# Altium schematic sheet P02_ Apollo 4 Blue Plus.SchDoc
size C; SheetNumber: 2; SheetTotal: 3
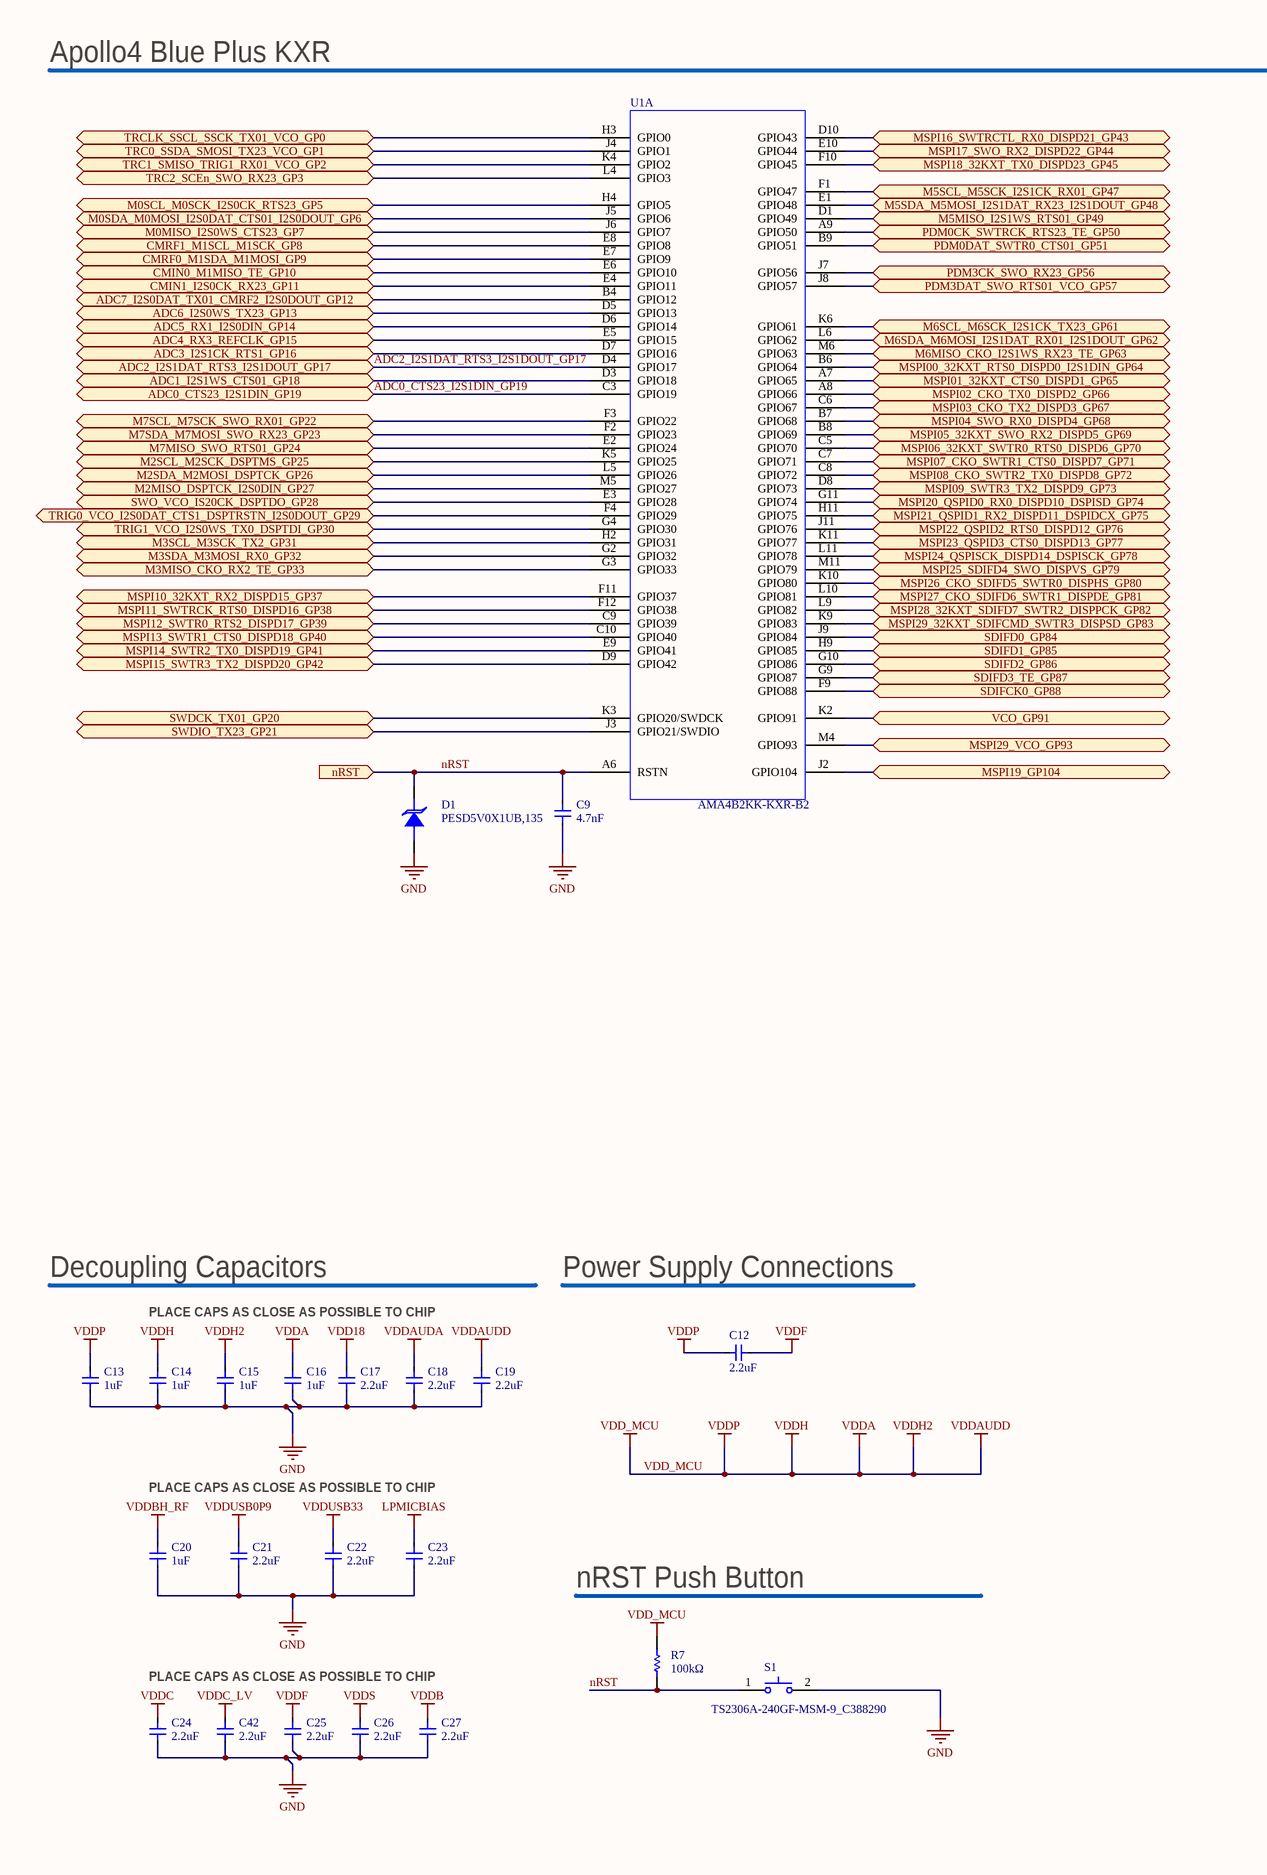
[diagram p0: P02_ Apollo 4 Blue Plus.SchDoc, left]
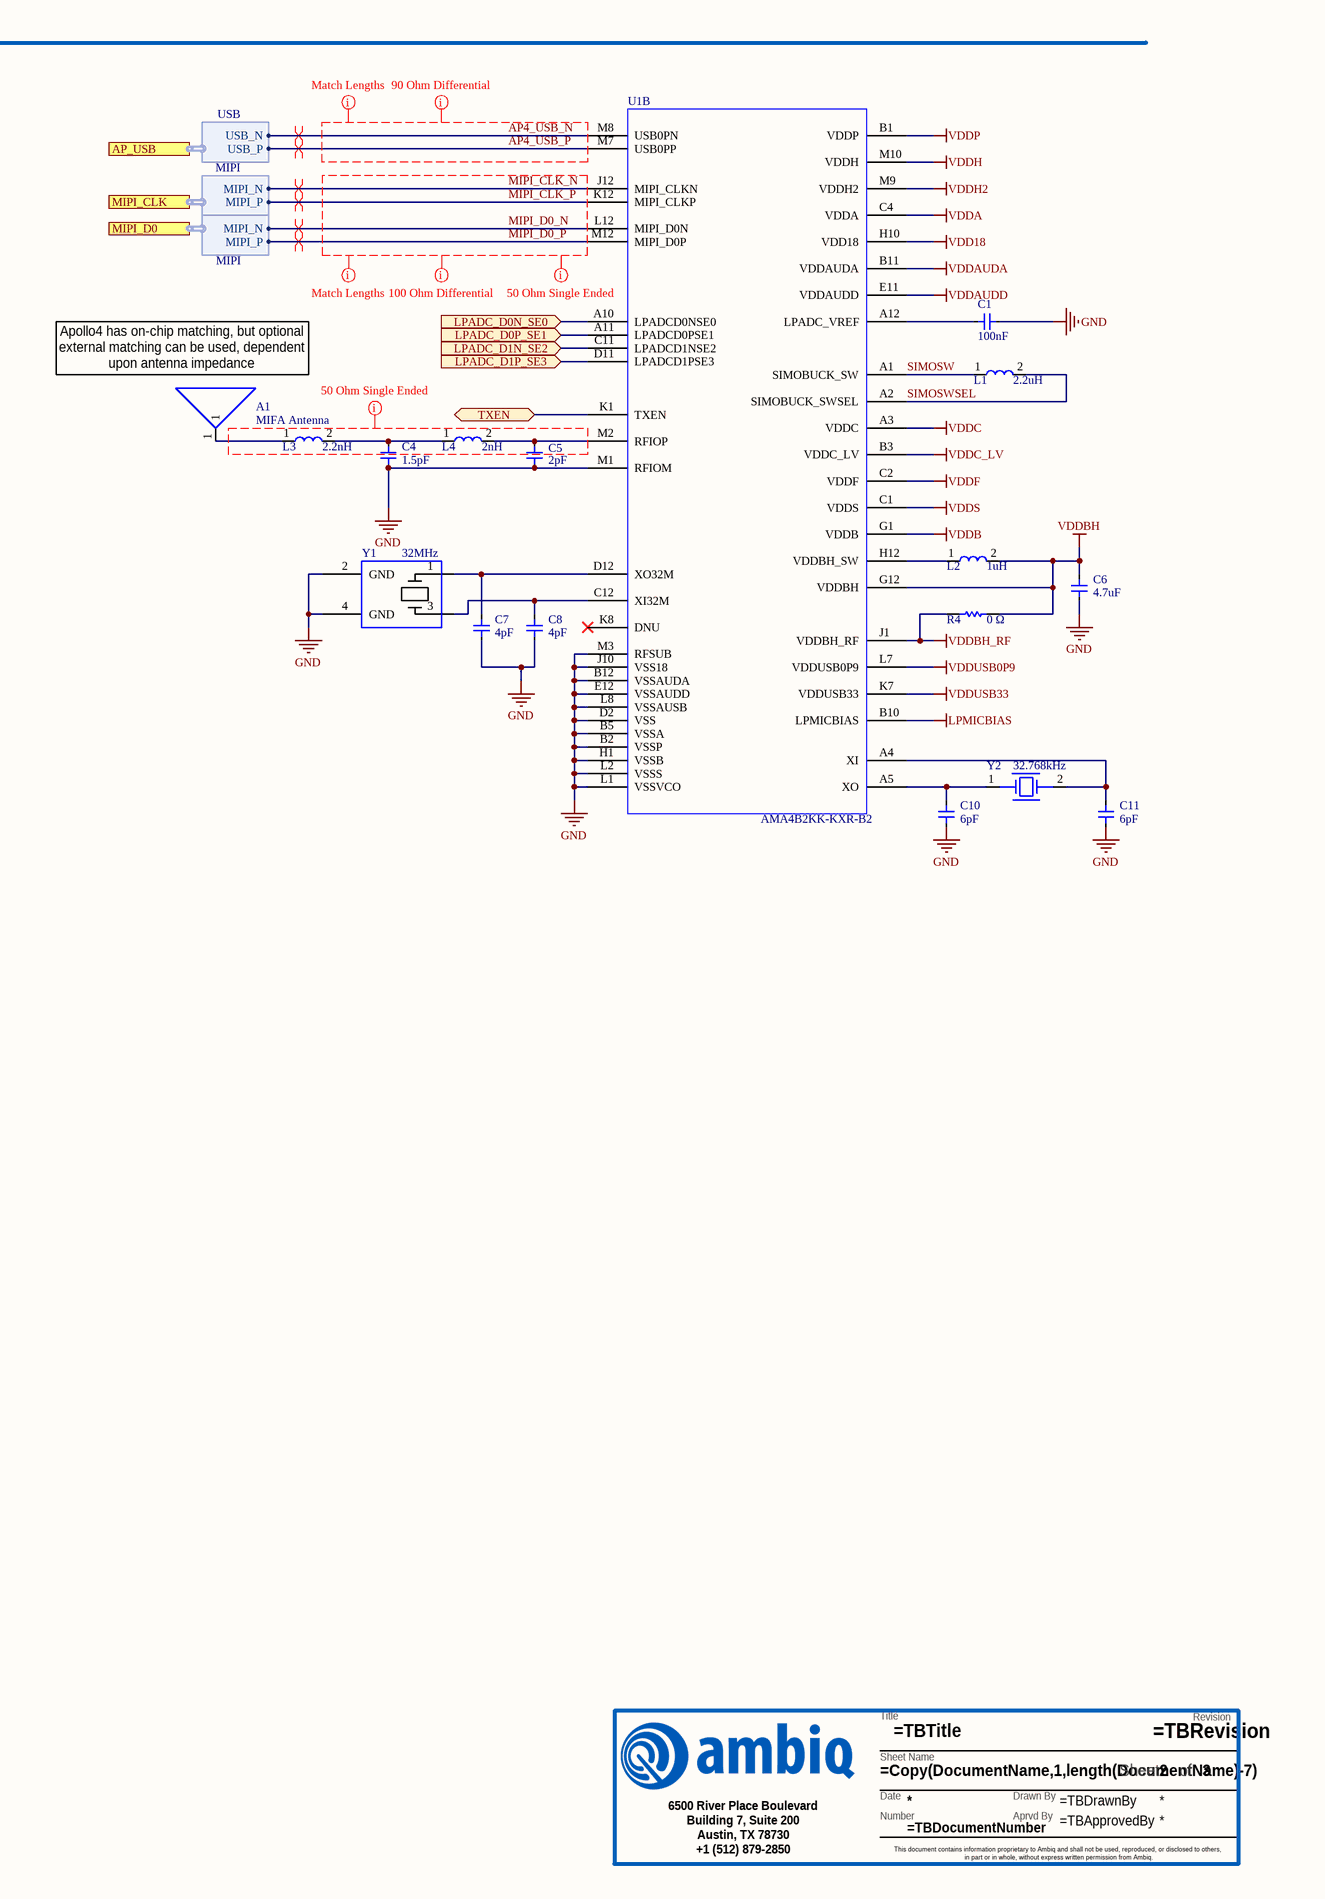
[diagram p1: P02_ Apollo 4 Blue Plus.SchDoc, right]

## Parts
?  TitleBlock  (value not drawn)  (graphical)
A1  MIFA Antenna  [ANT-2.4GHZ-8.0X1.0MM]  (no BOM)
C1  100nF  [IPC_B]
C4  1.5pF  [IPC_C_2]
C5  2pF  [IPC_C_2]
C6  4.7uF  [IPC_C_2]
C7  4pF  [IPC_C]
C8  4pF  [IPC_C]
C9  4.7nF  [IPC_C]
C10  6pF  [IPC_C]
C11  6pF  [IPC_C]
C12  2.2uF  [IPC_C]
C13  1uF  [IPC_C]
C14  1uF  [IPC_C]
C15  1uF  [IPC_C]
C16  1uF  [IPC_C]
C17  2.2uF  [IPC_C]
C18  2.2uF  [IPC_C]
C19  2.2uF  [IPC_C]
C20  1uF  [IPC_C]
C21  2.2uF  [IPC_C]
C22  2.2uF  [IPC_C]
C23  2.2uF  [IPC_C]
C24  2.2uF  [IPC_C]
C25  2.2uF  [IPC_C]
C26  2.2uF  [IPC_C]
C27  2.2uF  [IPC_C]
C42  2.2uF  [IPC_C]
D1  PESD5V0X1UB,135  [SC79]
L1  2.2uH  [IPC_C]
L2  1uH  [IPC_B_2]
L3  2.2nH  [IPC_C_4]
L4  2nH  [IPC_C_4]
R4  0 Ω  [IPC_C]
R7  100kΩ  [IPC_A]
S1  TS2306A-240GF-MSM-9_C388290  [TS2306A240GFMSM9_C388290]
U1  AMA4B2KK-KXR-B2  [BGA131_0P35_4P7X4P7]  (parts A,B of 2)
Y1  32MHz  [XOSC_ABM12W_1.2x1.6]
Y2  32.768kHz  [XTAL2-1P6X1P0-SM]

## Ports
ADC0_CTS23_I2S1DIN_GP19 (bidir), ADC1_I2S1WS_CTS01_GP18 (bidir), ADC2_I2S1DAT_RTS3_I2S1DOUT_GP17 (bidir), ADC3_I2S1CK_RTS1_GP16 (bidir), ADC4_RX3_REFCLK_GP15 (bidir), ADC5_RX1_I2S0DIN_GP14 (bidir), ADC6_I2S0WS_TX23_GP13 (bidir), ADC7_I2S0DAT_TX01_CMRF2_I2S0DOUT_GP12 (bidir), AP_USB (harness USB), CMIN0_M1MISO_TE_GP10 (bidir), CMIN1_I2S0CK_RX23_GP11 (bidir), CMRF0_M1SDA_M1MOSI_GP9 (bidir), CMRF1_M1SCL_M1SCK_GP8 (bidir), LPADC_D0N_SE0 (in), LPADC_D0P_SE1 (in), LPADC_D1N_SE2 (in), LPADC_D1P_SE3 (in), M0MISO_I2S0WS_CTS23_GP7 (bidir), M0SCL_M0SCK_I2S0CK_RTS23_GP5 (bidir), M0SDA_M0MOSI_I2S0DAT_CTS01_I2S0DOUT_GP6 (bidir), M2MISO_DSPTCK_I2S0DIN_GP27 (bidir), M2SCL_M2SCK_DSPTMS_GP25 (bidir), M2SDA_M2MOSI_DSPTCK_GP26 (bidir), M3MISO_CKO_RX2_TE_GP33 (bidir), M3SCL_M3SCK_TX2_GP31 (bidir), M3SDA_M3MOSI_RX0_GP32 (bidir), M5MISO_I2S1WS_RTS01_GP49 (bidir), M5SCL_M5SCK_I2S1CK_RX01_GP47 (bidir), M5SDA_M5MOSI_I2S1DAT_RX23_I2S1DOUT_GP48 (bidir), M6MISO_CKO_I2S1WS_RX23_TE_GP63 (bidir), M6SCL_M6SCK_I2S1CK_TX23_GP61 (bidir), M6SDA_M6MOSI_I2S1DAT_RX01_I2S1DOUT_GP62 (bidir), M7MISO_SWO_RTS01_GP24 (bidir), M7SCL_M7SCK_SWO_RX01_GP22 (bidir), M7SDA_M7MOSI_SWO_RX23_GP23 (bidir), MIPI_CLK (harness MIPI), MIPI_D0 (harness MIPI), MSPI00_32KXT_RTS0_DISPD0_I2S1DIN_GP64 (bidir), MSPI01_32KXT_CTS0_DISPD1_GP65 (bidir), MSPI02_CKO_TX0_DISPD2_GP66 (bidir), MSPI03_CKO_TX2_DISPD3_GP67 (bidir), MSPI04_SWO_RX0_DISPD4_GP68 (bidir), MSPI05_32KXT_SWO_RX2_DISPD5_GP69 (bidir), MSPI06_32KXT_SWTR0_RTS0_DISPD6_GP70 (bidir), MSPI07_CKO_SWTR1_CTS0_DISPD7_GP71 (bidir), MSPI08_CKO_SWTR2_TX0_DISPD8_GP72 (bidir), MSPI09_SWTR3_TX2_DISPD9_GP73 (bidir), MSPI10_32KXT_RX2_DISPD15_GP37 (bidir), MSPI11_SWTRCK_RTS0_DISPD16_GP38 (bidir), MSPI12_SWTR0_RTS2_DISPD17_GP39 (bidir), MSPI13_SWTR1_CTS0_DISPD18_GP40 (bidir), MSPI14_SWTR2_TX0_DISPD19_GP41 (bidir), MSPI15_SWTR3_TX2_DISPD20_GP42 (bidir), MSPI16_SWTRCTL_RX0_DISPD21_GP43 (bidir), MSPI17_SWO_RX2_DISPD22_GP44 (bidir), MSPI18_32KXT_TX0_DISPD23_GP45 (bidir), MSPI19_GP104 (bidir), MSPI20_QSPID0_RX0_DISPD10_DSPISD_GP74 (bidir), MSPI21_QSPID1_RX2_DISPD11_DSPIDCX_GP75 (bidir), MSPI22_QSPID2_RTS0_DISPD12_GP76 (bidir), MSPI23_QSPID3_CTS0_DISPD13_GP77 (bidir), MSPI24_QSPISCK_DISPD14_DSPISCK_GP78 (bidir), MSPI25_SDIFD4_SWO_DISPVS_GP79 (bidir), MSPI26_CKO_SDIFD5_SWTR0_DISPHS_GP80 (bidir), MSPI27_CKO_SDIFD6_SWTR1_DISPDE_GP81 (bidir), MSPI28_32KXT_SDIFD7_SWTR2_DISPPCK_GP82 (bidir), MSPI29_32KXT_SDIFCMD_SWTR3_DISPSD_GP83 (bidir), MSPI29_VCO_GP93 (bidir), nRST (in), PDM0CK_SWTRCK_RTS23_TE_GP50 (bidir), PDM0DAT_SWTR0_CTS01_GP51 (bidir), PDM3CK_SWO_RX23_GP56 (bidir), PDM3DAT_SWO_RTS01_VCO_GP57 (bidir), SDIFCK0_GP88 (bidir), SDIFD0_GP84 (bidir), SDIFD1_GP85 (bidir), SDIFD2_GP86 (bidir), SDIFD3_TE_GP87 (bidir), SWDCK_TX01_GP20 (bidir), SWDIO_TX23_GP21 (bidir), SWO_VCO_IS20CK_DSPTDO_GP28 (bidir), TRC0_SSDA_SMOSI_TX23_VCO_GP1 (bidir), TRC1_SMISO_TRIG1_RX01_VCO_GP2 (bidir), TRC2_SCEn_SWO_RX23_GP3 (bidir), TRCLK_SSCL_SSCK_TX01_VCO_GP0 (bidir), TRIG0_VCO_I2S0DAT_CTS1_DSPTRSTN_I2S0DOUT_GP29 (bidir), TRIG1_VCO_I2S0WS_TX0_DSPTDI_GP30 (bidir), TXEN (bidir), VCO_GP91 (bidir)

## Harnesses
MIPI: MIPI_N, MIPI_P
USB: USB_N, USB_P

## Nets
GND: C1.2 C4.2 C5.2 C6.2 C7.2 C8.2 C9.2 C10.2 C11.2 C13.2 C14.2 C15.2 C16.2 C17.2 C18.2 C19.2 C20.2 C21.2 C22.2 C23.2 C24.2 C25.2 C26.2 C27.2 C42.2 D1.2(A) S1.2(COM) U1.B2(VSSP) U1.B5(VSSA) U1.B12(VSSAUDA) U1.D2(VSS) U1.E12(VSSAUDD) U1.H1(VSSB) U1.J10(VSS18) U1.L1(VSSVCO) U1.L2(VSSS) U1.L8(VSSAUSB) U1.M1(RFIOM) U1.M3(RFSUB) Y1.2(GND) Y1.4(GND)
LPMICBIAS: C23.1 U1.B10(LPMICBIAS)
VDD18: C17.1 U1.H10(VDD18)
VDD_MCU: C12.1 C13.1 C14.1 C15.1 C16.1 C19.1 R7.2 U1.B1(VDDP) U1.C4(VDDA) U1.E11(VDDAUDD) U1.M9(VDDH2) U1.M10(VDDH)  [also labelled VDDA, VDDAUDD, VDDH, VDDH2, VDDP]
VDDAUDA: C18.1 U1.B11(VDDAUDA)
VDDB: C27.1 U1.G1(VDDB)
VDDBH: C6.1 L2.2 R4.2 U1.G12(VDDBH)
VDDBH_RF: C20.1 R4.1 U1.J1(VDDBH_RF)
VDDC: C24.1 U1.A3(VDDC)
VDDC_LV: C42.1 U1.B3(VDDC_LV)
VDDF: C12.2 C25.1 U1.C2(VDDF)
VDDS: C26.1 U1.C1(VDDS)
VDDUSB0P9: C21.1 U1.L7(VDDUSB0P9)
VDDUSB33: C22.1 U1.K7(VDDUSB33)
ADC0_CTS23_I2S1DIN_GP19: U1.C3(GPIO19) ; port ADC0_CTS23_I2S1DIN_GP19
ADC1_I2S1WS_CTS01_GP18: U1.D3(GPIO18) ; port ADC1_I2S1WS_CTS01_GP18
ADC2_I2S1DAT_RTS3_I2S1DOUT_GP17: U1.D4(GPIO17) ; port ADC2_I2S1DAT_RTS3_I2S1DOUT_GP17
ADC3_I2S1CK_RTS1_GP16: U1.D7(GPIO16) ; port ADC3_I2S1CK_RTS1_GP16
ADC4_RX3_REFCLK_GP15: U1.E5(GPIO15) ; port ADC4_RX3_REFCLK_GP15
ADC5_RX1_I2S0DIN_GP14: U1.D6(GPIO14) ; port ADC5_RX1_I2S0DIN_GP14
ADC6_I2S0WS_TX23_GP13: U1.D5(GPIO13) ; port ADC6_I2S0WS_TX23_GP13
ADC7_I2S0DAT_TX01_CMRF2_I2S0DOUT_GP12: U1.B4(GPIO12) ; port ADC7_I2S0DAT_TX01_CMRF2_I2S0DOUT_GP12
AP4_USB_N: U1.M8(USB0PN) ; port AP_USB.USB_N
AP4_USB_P: U1.M7(USB0PP) ; port AP_USB.USB_P
CMIN0_M1MISO_TE_GP10: U1.E6(GPIO10) ; port CMIN0_M1MISO_TE_GP10
CMIN1_I2S0CK_RX23_GP11: U1.E4(GPIO11) ; port CMIN1_I2S0CK_RX23_GP11
CMRF0_M1SDA_M1MOSI_GP9: U1.E7(GPIO9) ; port CMRF0_M1SDA_M1MOSI_GP9
CMRF1_M1SCL_M1SCK_GP8: U1.E8(GPIO8) ; port CMRF1_M1SCL_M1SCK_GP8
LPADC_D0N_SE0: U1.A10(LPADCD0NSE0) ; port LPADC_D0N_SE0
LPADC_D0P_SE1: U1.A11(LPADCD0PSE1) ; port LPADC_D0P_SE1
LPADC_D1N_SE2: U1.C11(LPADCD1NSE2) ; port LPADC_D1N_SE2
LPADC_D1P_SE3: U1.D11(LPADCD1PSE3) ; port LPADC_D1P_SE3
M0MISO_I2S0WS_CTS23_GP7: U1.J6(GPIO7) ; port M0MISO_I2S0WS_CTS23_GP7
M0SCL_M0SCK_I2S0CK_RTS23_GP5: U1.H4(GPIO5) ; port M0SCL_M0SCK_I2S0CK_RTS23_GP5
M0SDA_M0MOSI_I2S0DAT_CTS01_I2S0DOUT_GP6: U1.J5(GPIO6) ; port M0SDA_M0MOSI_I2S0DAT_CTS01_I2S0DOUT_GP6
M2MISO_DSPTCK_I2S0DIN_GP27: U1.M5(GPIO27) ; port M2MISO_DSPTCK_I2S0DIN_GP27
M2SCL_M2SCK_DSPTMS_GP25: U1.K5(GPIO25) ; port M2SCL_M2SCK_DSPTMS_GP25
M2SDA_M2MOSI_DSPTCK_GP26: U1.L5(GPIO26) ; port M2SDA_M2MOSI_DSPTCK_GP26
M3MISO_CKO_RX2_TE_GP33: U1.G3(GPIO33) ; port M3MISO_CKO_RX2_TE_GP33
M3SCL_M3SCK_TX2_GP31: U1.H2(GPIO31) ; port M3SCL_M3SCK_TX2_GP31
M3SDA_M3MOSI_RX0_GP32: U1.G2(GPIO32) ; port M3SDA_M3MOSI_RX0_GP32
M5MISO_I2S1WS_RTS01_GP49: U1.D1(GPIO49) ; port M5MISO_I2S1WS_RTS01_GP49
M5SCL_M5SCK_I2S1CK_RX01_GP47: U1.F1(GPIO47) ; port M5SCL_M5SCK_I2S1CK_RX01_GP47
M5SDA_M5MOSI_I2S1DAT_RX23_I2S1DOUT_GP48: U1.E1(GPIO48) ; port M5SDA_M5MOSI_I2S1DAT_RX23_I2S1DOUT_GP48
M6MISO_CKO_I2S1WS_RX23_TE_GP63: U1.M6(GPIO63) ; port M6MISO_CKO_I2S1WS_RX23_TE_GP63
M6SCL_M6SCK_I2S1CK_TX23_GP61: U1.K6(GPIO61) ; port M6SCL_M6SCK_I2S1CK_TX23_GP61
M6SDA_M6MOSI_I2S1DAT_RX01_I2S1DOUT_GP62: U1.L6(GPIO62) ; port M6SDA_M6MOSI_I2S1DAT_RX01_I2S1DOUT_GP62
M7MISO_SWO_RTS01_GP24: U1.E2(GPIO24) ; port M7MISO_SWO_RTS01_GP24
M7SCL_M7SCK_SWO_RX01_GP22: U1.F3(GPIO22) ; port M7SCL_M7SCK_SWO_RX01_GP22
M7SDA_M7MOSI_SWO_RX23_GP23: U1.F2(GPIO23) ; port M7SDA_M7MOSI_SWO_RX23_GP23
MIPI_CLK_N: U1.J12(MIPI_CLKN) ; port MIPI_CLK.MIPI_N
MIPI_CLK_P: U1.K12(MIPI_CLKP) ; port MIPI_CLK.MIPI_P
MIPI_D0_N: U1.L12(MIPI_D0N) ; port MIPI_D0.MIPI_N
MIPI_D0_P: U1.M12(MIPI_D0P) ; port MIPI_D0.MIPI_P
MSPI00_32KXT_RTS0_DISPD0_I2S1DIN_GP64: U1.B6(GPIO64) ; port MSPI00_32KXT_RTS0_DISPD0_I2S1DIN_GP64
MSPI01_32KXT_CTS0_DISPD1_GP65: U1.A7(GPIO65) ; port MSPI01_32KXT_CTS0_DISPD1_GP65
MSPI02_CKO_TX0_DISPD2_GP66: U1.A8(GPIO66) ; port MSPI02_CKO_TX0_DISPD2_GP66
MSPI03_CKO_TX2_DISPD3_GP67: U1.C6(GPIO67) ; port MSPI03_CKO_TX2_DISPD3_GP67
MSPI04_SWO_RX0_DISPD4_GP68: U1.B7(GPIO68) ; port MSPI04_SWO_RX0_DISPD4_GP68
MSPI05_32KXT_SWO_RX2_DISPD5_GP69: U1.B8(GPIO69) ; port MSPI05_32KXT_SWO_RX2_DISPD5_GP69
MSPI06_32KXT_SWTR0_RTS0_DISPD6_GP70: U1.C5(GPIO70) ; port MSPI06_32KXT_SWTR0_RTS0_DISPD6_GP70
MSPI07_CKO_SWTR1_CTS0_DISPD7_GP71: U1.C7(GPIO71) ; port MSPI07_CKO_SWTR1_CTS0_DISPD7_GP71
MSPI08_CKO_SWTR2_TX0_DISPD8_GP72: U1.C8(GPIO72) ; port MSPI08_CKO_SWTR2_TX0_DISPD8_GP72
MSPI09_SWTR3_TX2_DISPD9_GP73: U1.D8(GPIO73) ; port MSPI09_SWTR3_TX2_DISPD9_GP73
MSPI10_32KXT_RX2_DISPD15_GP37: U1.F11(GPIO37) ; port MSPI10_32KXT_RX2_DISPD15_GP37
MSPI11_SWTRCK_RTS0_DISPD16_GP38: U1.F12(GPIO38) ; port MSPI11_SWTRCK_RTS0_DISPD16_GP38
MSPI12_SWTR0_RTS2_DISPD17_GP39: U1.C9(GPIO39) ; port MSPI12_SWTR0_RTS2_DISPD17_GP39
MSPI13_SWTR1_CTS0_DISPD18_GP40: U1.C10(GPIO40) ; port MSPI13_SWTR1_CTS0_DISPD18_GP40
MSPI14_SWTR2_TX0_DISPD19_GP41: U1.E9(GPIO41) ; port MSPI14_SWTR2_TX0_DISPD19_GP41
MSPI15_SWTR3_TX2_DISPD20_GP42: U1.D9(GPIO42) ; port MSPI15_SWTR3_TX2_DISPD20_GP42
MSPI16_SWTRCTL_RX0_DISPD21_GP43: U1.D10(GPIO43) ; port MSPI16_SWTRCTL_RX0_DISPD21_GP43
MSPI17_SWO_RX2_DISPD22_GP44: U1.E10(GPIO44) ; port MSPI17_SWO_RX2_DISPD22_GP44
MSPI18_32KXT_TX0_DISPD23_GP45: U1.F10(GPIO45) ; port MSPI18_32KXT_TX0_DISPD23_GP45
MSPI19_GP104: U1.J2(GPIO104) ; port MSPI19_GP104
MSPI20_QSPID0_RX0_DISPD10_DSPISD_GP74: U1.G11(GPIO74) ; port MSPI20_QSPID0_RX0_DISPD10_DSPISD_GP74
MSPI21_QSPID1_RX2_DISPD11_DSPIDCX_GP75: U1.H11(GPIO75) ; port MSPI21_QSPID1_RX2_DISPD11_DSPIDCX_GP75
MSPI22_QSPID2_RTS0_DISPD12_GP76: U1.J11(GPIO76) ; port MSPI22_QSPID2_RTS0_DISPD12_GP76
MSPI23_QSPID3_CTS0_DISPD13_GP77: U1.K11(GPIO77) ; port MSPI23_QSPID3_CTS0_DISPD13_GP77
MSPI24_QSPISCK_DISPD14_DSPISCK_GP78: U1.L11(GPIO78) ; port MSPI24_QSPISCK_DISPD14_DSPISCK_GP78
MSPI25_SDIFD4_SWO_DISPVS_GP79: U1.M11(GPIO79) ; port MSPI25_SDIFD4_SWO_DISPVS_GP79
MSPI26_CKO_SDIFD5_SWTR0_DISPHS_GP80: U1.K10(GPIO80) ; port MSPI26_CKO_SDIFD5_SWTR0_DISPHS_GP80
MSPI27_CKO_SDIFD6_SWTR1_DISPDE_GP81: U1.L10(GPIO81) ; port MSPI27_CKO_SDIFD6_SWTR1_DISPDE_GP81
MSPI28_32KXT_SDIFD7_SWTR2_DISPPCK_GP82: U1.L9(GPIO82) ; port MSPI28_32KXT_SDIFD7_SWTR2_DISPPCK_GP82
MSPI29_32KXT_SDIFCMD_SWTR3_DISPSD_GP83: U1.K9(GPIO83) ; port MSPI29_32KXT_SDIFCMD_SWTR3_DISPSD_GP83
MSPI29_VCO_GP93: U1.M4(GPIO93) ; port MSPI29_VCO_GP93
nRST: C9.1 D1.1(C) R7.1 S1.1(NO) U1.A6(RSTN) ; port nRST
PDM0CK_SWTRCK_RTS23_TE_GP50: U1.A9(GPIO50) ; port PDM0CK_SWTRCK_RTS23_TE_GP50
PDM0DAT_SWTR0_CTS01_GP51: U1.B9(GPIO51) ; port PDM0DAT_SWTR0_CTS01_GP51
PDM3CK_SWO_RX23_GP56: U1.J7(GPIO56) ; port PDM3CK_SWO_RX23_GP56
PDM3DAT_SWO_RTS01_VCO_GP57: U1.J8(GPIO57) ; port PDM3DAT_SWO_RTS01_VCO_GP57
SDIFCK0_GP88: U1.F9(GPIO88) ; port SDIFCK0_GP88
SDIFD0_GP84: U1.J9(GPIO84) ; port SDIFD0_GP84
SDIFD1_GP85: U1.H9(GPIO85) ; port SDIFD1_GP85
SDIFD2_GP86: U1.G10(GPIO86) ; port SDIFD2_GP86
SDIFD3_TE_GP87: U1.G9(GPIO87) ; port SDIFD3_TE_GP87
SIMOSW: L1.1 U1.A1(SIMOBUCK_SW)
SIMOSWSEL: L1.2 U1.A2(SIMOBUCK_SWSEL)
SWDCK_TX01_GP20: U1.K3(GPIO20/SWDCK) ; port SWDCK_TX01_GP20
SWDIO_TX23_GP21: U1.J3(GPIO21/SWDIO) ; port SWDIO_TX23_GP21
SWO_VCO_IS20CK_DSPTDO_GP28: U1.E3(GPIO28) ; port SWO_VCO_IS20CK_DSPTDO_GP28
TRC0_SSDA_SMOSI_TX23_VCO_GP1: U1.J4(GPIO1) ; port TRC0_SSDA_SMOSI_TX23_VCO_GP1
TRC1_SMISO_TRIG1_RX01_VCO_GP2: U1.K4(GPIO2) ; port TRC1_SMISO_TRIG1_RX01_VCO_GP2
TRC2_SCEn_SWO_RX23_GP3: U1.L4(GPIO3) ; port TRC2_SCEn_SWO_RX23_GP3
TRCLK_SSCL_SSCK_TX01_VCO_GP0: U1.H3(GPIO0) ; port TRCLK_SSCL_SSCK_TX01_VCO_GP0
TRIG0_VCO_I2S0DAT_CTS1_DSPTRSTN_I2S0DOUT_GP29: U1.F4(GPIO29) ; port TRIG0_VCO_I2S0DAT_CTS1_DSPTRSTN_I2S0DOUT_GP29
TRIG1_VCO_I2S0WS_TX0_DSPTDI_GP30: U1.G4(GPIO30) ; port TRIG1_VCO_I2S0WS_TX0_DSPTDI_GP30
TXEN: U1.K1(TXEN) ; port TXEN
VCO_GP91: U1.K2(GPIO91) ; port VCO_GP91
NetA1_1: A1.1 L3.1
NetC1_1: C1.1 U1.A12(LPADC_VREF)
NetC4_1: C4.1 L3.2 L4.1
NetC5_1: C5.1 L4.2 U1.M2(RFIOP)
NetC7_1: C7.1 U1.D12(XO32M) Y1.1
NetC8_1: C8.1 U1.C12(XI32M) Y1.3
NetC10_1: C10.1 U1.A5(XO) Y2.1
NetC11_1: C11.1 U1.A4(XI) Y2.2
NetL2_1: L2.1 U1.H12(VDDBH_SW)

Not connected (* = marked no-connect by the designer): U1 K8(DNU)*

## Layout directives
differential pair; differential pair class AP_USB: AP4_USB_N, AP4_USB_P
rule Impedance Constraint [Min = 85.00    Max = 95.00    ]; rule Differential Pairs Routing [Pref Gap = 6mil    Min Gap  = 5mil    Max Gap  = 7milPref Width = 4mil    Min Width  = 3mil    Max Width  = 5mil]: AP4_USB_N, AP4_USB_P
rule Impedance Constraint [Min = 95.00    Max = 105.0    ]: MIPI_CLK_N, MIPI_CLK_P, MIPI_D0_N, MIPI_D0_P
rule Matched Net Lengths [Tolerance = 100mil]: AP4_USB_N, AP4_USB_P, MIPI_CLK_N, MIPI_CLK_P, MIPI_D0_N, MIPI_D0_P
differential pair; differential pair class MIPI_CLK: MIPI_CLK_N, MIPI_CLK_P
differential pair; differential pair class MIPI_D0: MIPI_D0_N, MIPI_D0_P
mark named 50 Ohm Single Ended: (no net found under the mark), MIPI_CLK_N, MIPI_CLK_P, MIPI_D0_N, MIPI_D0_P

## Notes on the sheet
- Apollo4 Blue Plus KXR
- Apollo4 has on-chip matching, but optional external matching can be used, dependent upon antenna impedance
- Decoupling Capacitors
- PLACE CAPS AS CLOSE AS POSSIBLE TO CHIP
- Power Supply Connections
- nRST Push Button
- (in symbol TitleBlock) Revision; Title; Sheet Name; Sheet; of; Date; Drawn By; Number; Aprvd By; 6500 River Place Boulevard / Building 7, Suite 200 / Austin, TX 78730 / +1 (512) 879-2850; This document contains information proprietary to Ambiq and shall not be used, reproduced, or disclosed to others, / in part or in whole, without express written permission from Ambiq.

## Library data of the parts
? = TitleBlock: Title block for Ambiq Schematics. Please have the following parameters entered in Project>Project Options>Parameters: / TBTitle / TBDocumentNumber / TBRevision / TBDrawnBy / TBApprovedBy; AMBIQ PN: TitleBlock
A1 = Ceramic _ANTENNA: None; AMBIQ PN: PCB_ANTENNA
C1 = Capacitor: NONE; Manufacturer: Murata; AMBIQ PN: GRM033R61A225KE47D; Capacitance: 2.2uF; Tolerance: 10%; Voltage Rating: 10V; Dielectric: X5R; Supplier 1: Arrow Electronics; Supplier Part Number 1: GRM033R61A225KE47D; Manufacturer Part Number: GRM033R61A225KE47D; RoHS: Yes; Category: Ceramic Capacitors; Stock 1: 990; Pricing 1: 1=0.27590, 10=0.23000, 25=0.18010, 100=0.10000, 250=0.09900, 500=0.06860, 1000=0.06790, 3000=0.06720, 6000=0.05140, 15000=0.050; Mount: Surface Mount; Case/Package: 0201; Case Code (Metric): 0603; Case Code (Imperial): 0201; Min Operating Temperature: -55°C; Max Operating Temperature: 85°C; Packaging: Tape and Reel; Voltage Rating (DC): 10V; Length: 0.024inch; Width: 0.012inch; Thickness: 0.015inch; RoHS Compliant: Yes; ComponentLink1URL: http://search.murata.co.jp/Ceramy/image/img/A01X/G101/ENG/GRM033R61A225KE47-01.pdf?src-supplier=Digi-Key; ComponentLink1Description: http://search.murata.co.jp/Ceramy/image/img/A01X/G101/ENG/GRM033R61A225KE47-01.pdf?src-supplier=Digi-Key
C4 = Capacitor: NONE; Manufacturer: Murata; AMBIQ PN: GRM1555C1H1R5CA01D; Supplier 1: Avnet; Supplier Part Number 1: GRM1555C1H1R5CA01D; Manufacturer Part Number: GRM1555C1H1R5CA01D; RoHS: Yes; Category: Ceramic Capacitors; Stock 1: 20000; Pricing 1: 10000=0.00487, 20000=0.00476, 40000=0.00465 (USD); Mount: Surface Mount; Case/Package: 0402; Case Code (Metric): 1005; Case Code (Imperial): 0402; Capacitance: 1.5pF; Mounting Technology: Surface Mount
C5 = Capacitor: NONE; Manufacturer: Murata; AMBIQ PN: GRM1555C1H2R0WA01D; Tolerance: 1%; Dielectric: C0G; Supplier 1: Arrow Electronics; Supplier Part Number 1: GRM1555C1H2R0WA01D; Manufacturer Part Number: GRM1555C1H2R0WA01D; RoHS: Yes; Category: Ceramic Capacitors; Stock 1: 54; Pricing 1: 1=0.10000, 10=0.05720, 25=0.05660, 100=0.03540, 250=0.03000 (USD); Mount: Surface Mount; Case/Package: 0402; Case Code (Metric): 1005; Case Code (Imperial): 0402; Capacitance: 2pF
C6 = Capacitor: NONE; Manufacturer: Murata; AMBIQ PN: GRM155R60G475ME87D; Tolerance: 20%; Voltage Rating: 4V; Dielectric: X5R; Supplier 1: Arrow Electronics; Supplier Part Number 1: GRM155R60G475ME87D; Manufacturer Part Number: GRM155R60G475ME87D; RoHS: Yes; Category: Ceramic Capacitors; Stock 1: 79890; Pricing 1: 1=0.12440, 10=0.07530, 25=0.07460, 100=0.04310, 250=0.04270, 500=0.02940, 1000=0.02580, 3000=0.02370, 6000=0.02210, 15000=0.021; Mount: Surface Mount; Case/Package: 0402; Case Code (Metric): 1005; Case Code (Imperial): 0402; Min Operating Temperature: -55°C; Max Operating Temperature: 85°C; Capacitance: 4.7uF; Packaging: Tape and Reel; Voltage: 4V; Voltage Rating (DC): 4V; Series: GRM; Construction: Flat; Length: 1mm; Width: 0.02inch; Height: 0.5mm; Thickness: 0.026inch; Depth: 0.5mm; Radiation Hardening: No; REACH SVHC: No SVHC; Lead Free: Lead Free; RoHS Compliant: Yes; ComponentLink1URL: https://datasheet.ciiva.com/11613/c02e-11613181.pdf?src-supplier=Avnet; ComponentLink1Description: https://datasheet.ciiva.com/11613/c02e-11613181.pdf?src-supplier=Avnet
C7 C8 = Capacitor: NONE; Manufacturer: Murata; AMBIQ PN: GRM0335C1H4R0BA01D; Voltage Rating: 50V; Dielectric: C0G; Supplier 1: Arrow Electronics; Supplier Part Number 1: GRM0335C1H4R0BA01D; Manufacturer Part Number: GRM0335C1H4R0BA01D; RoHS: Yes; Category: Ceramic Capacitors; Stock 1: 3508; Pricing 1: 1=0.09680, 10=0.01620, 25=0.01560, 100=0.00890, 250=0.00860, 500=0.00620, 3000=0.00530 (USD); Mount: Surface Mount; Case/Package: 0201; Case Code (Metric): 0603; Case Code (Imperial): 0201; Min Operating Temperature: -55°C; Max Operating Temperature: 125°C; Capacitance: 4pF; Packaging: Tape and Reel; Voltage Rating (DC): 50V; Series: GRM; Length: 0.6mm; Width: 0.012inch; Height: 0.3mm; Thickness: 0.013inch; Depth: 0.3mm; ComponentLink1URL: http://www.mouser.com/ds/2/281/c02e-2905.pdf?src-supplier=Mouser; ComponentLink1Description: http://www.mouser.com/ds/2/281/c02e-2905.pdf?src-supplier=Mouser; Package Quantity: 15000; Termination: SMD/SMT
C9 = Capacitor: NONE; Manufacturer: Murata; AMBIQ PN: GRM155R61C472KA01D; Tolerance: 10%; Voltage Rating: 16V; Dielectric: X5R; Supplier 1: Arrow Electronics; Supplier Part Number 1: GRM155R61C472KA01D; Manufacturer Part Number: GRM155R61C472KA01D; RoHS: Yes; Category: Ceramic Capacitors; Stock 1: 3; Pricing 1: 1=0.07090 (USD); Mount: Surface Mount; Case/Package: 0402; Case Code (Metric): 1005; Case Code (Imperial): 0402; Min Operating Temperature: -55°C; Max Operating Temperature: 85°C; Capacitance: 4.7nF; Packaging: Tape and Reel; Voltage Rating (DC): 16V; Series: GRM; Construction: Flat; Length: 1mm; Width: 0.02inch; Height: 0.5mm; Thickness: 0.022inch; Depth: 0.5mm; Radiation Hardening: No; RoHS Compliant: Yes; ComponentLink1URL: https://datasheet.ciiva.com/11620/product-11620403.pdf?src-supplier=Avnet; ComponentLink1Description: https://datasheet.ciiva.com/11620/product-11620403.pdf?src-supplier=Avnet; Package Quantity: 10000; Termination: SMD/SMT
C10 C11 = Capacitor: NONE; Manufacturer: Murata; AMBIQ PN: GRM0335C1H6R0BA01D; Voltage Rating: 50V; Dielectric: C0G; Supplier 1: Arrow Electronics; Supplier Part Number 1: GRM0335C1H6R0BA01D; Manufacturer Part Number: GRM0335C1H6R0BA01D; RoHS: Yes; Category: Ceramic Capacitors; Stock 1: 4052; Pricing 1: 1=0.06400, 10=0.01810, 25=0.01250, 100=0.00850, 250=0.00840, 500=0.00620, 1000=0.00510, 3000=0.00460 (USD); Mount: Surface Mount; Case/Package: 0201; Case Code (Metric): 0603; Case Code (Imperial): 0201; Min Operating Temperature: -55°C; Max Operating Temperature: 125°C; Capacitance: 6pF; Packaging: Tape and Reel; Voltage Rating (DC): 50V; Series: GRM; Length: 0.024inch; Width: 0.012inch; Height: 0.3mm; Thickness: 0.013inch; RoHS Compliant: Yes; ComponentLink1URL: http://www.mouser.com/ds/2/281/c02e-2905.pdf?src-supplier=Mouser; ComponentLink1Description: http://www.mouser.com/ds/2/281/c02e-2905.pdf?src-supplier=Mouser; Package Quantity: 15000; Termination: SMD/SMT
C12 C17-C19 C21-C27 C42 = Capacitor: NONE; Manufacturer: Murata; AMBIQ PN: GRM033R61A225KE47D; Tolerance: 10%; Voltage Rating: 10V; Dielectric: X5R; Supplier 1: Arrow Electronics; Supplier Part Number 1: GRM033R61A225KE47D; Manufacturer Part Number: GRM033R61A225KE47D; RoHS: Yes; Category: Ceramic Capacitors; Stock 1: 990; Pricing 1: 1=0.27590, 10=0.23000, 25=0.18010, 100=0.10000, 250=0.09900, 500=0.06860, 1000=0.06790, 3000=0.06720, 6000=0.05140, 15000=0.050; Mount: Surface Mount; Case/Package: 0201; Case Code (Metric): 0603; Case Code (Imperial): 0201; Min Operating Temperature: -55°C; Max Operating Temperature: 85°C; Capacitance: 2.2uF; Packaging: Tape and Reel; Voltage Rating (DC): 10V; Length: 0.024inch; Width: 0.012inch; Thickness: 0.015inch; RoHS Compliant: Yes; ComponentLink1URL: http://search.murata.co.jp/Ceramy/image/img/A01X/G101/ENG/GRM033R61A225KE47-01.pdf?src-supplier=Digi-Key; ComponentLink1Description: http://search.murata.co.jp/Ceramy/image/img/A01X/G101/ENG/GRM033R61A225KE47-01.pdf?src-supplier=Digi-Key
C13-C16 C20 = Capacitor: NONE; Manufacturer: Murata; AMBIQ PN: GRM033R61A105ME15D; Tolerance: 20%; Voltage Rating: 10V; Dielectric: X5R; Supplier 1: Arrow Electronics; Supplier Part Number 1: GRM033R61A105ME15D; Manufacturer Part Number: GRM033R61A105ME15D; RoHS: Yes; Category: Ceramic Capacitors; Stock 1: 387591; Pricing 1: 1=0.35440, 10=0.26860, 25=0.26600, 50=0.24050, 100=0.18220, 250=0.18020, 500=0.17800, 1000=0.12040, 3000=0.11920, 6000=0.08160,; Mount: Surface Mount; Case/Package: 0201; Case Code (Metric): 0603; Case Code (Imperial): 0201; Min Operating Temperature: -55°C; Max Operating Temperature: 85°C; Capacitance: 1uF; Packaging: Tape and Reel; Voltage Rating (DC): 10V; Length: 0.024inch; Width: 0.012inch; Thickness: 0.015inch; RoHS Compliant: Yes; ComponentLink1URL: http://search.murata.co.jp/Ceramy/image/img/A01X/G101/ENG/GRM033R61A105ME15-01.pdf?src-supplier=Digi-Key; ComponentLink1Description: http://search.murata.co.jp/Ceramy/image/img/A01X/G101/ENG/GRM033R61A105ME15-01.pdf?src-supplier=Digi-Key
D1 = PESD5V0X1UB,135: None; Manufacturer: Nexperia; AMBIQ PN: PESD5V0X1UB,135; Supplier 1: RSComponents; Supplier Part Number 1: 1704867; Manufacturer Part Number: PESD5V0X1UB,135; RoHS: Yes; Category: ESD and Circuit Protection ICs; Stock 1: 1; Pricing 1: 10000=0.12700 (USD); RoHS Compliant: Yes; ComponentLink1URL: https://www.mouser.com/ds/2/302/PESD5V0X1UB-1151612.pdf?src-supplier=Mouser; ComponentLink1Description: https://www.mouser.com/ds/2/302/PESD5V0X1UB-1151612.pdf?src-supplier=Mouser
L1 = Inductor: NONE; Manufacturer: Murata; AMBIQ PN: DFE201210U-2R2M=P2; Supplier 1: Arrow Electronics; Supplier Part Number 1: DFE201210U-2R2M=P2; Manufacturer Part Number: DFE201210U-2R2M=P2; RoHS: Yes; Category: Fixed Inductors; Stock 1: 206; Pricing 1: 1=0.40140, 10=0.29940, 25=0.27320, 100=0.22140 (USD); RoHS Compliant: Yes; ComponentLink1URL: http://search.murata.co.jp/Ceramy/image/img/P02/J(E)TE243A-0029_DFE201210U_reference.pdf?src-supplier=Digi-Key; ComponentLink1Description: http://search.murata.co.jp/Ceramy/image/img/P02/J(E)TE243A-0029_DFE201210U_reference.pdf?src-supplier=Digi-Key; Case/Package: 0805
L2 = Inductor: NONE; Manufacturer: Murata; AMBIQ PN: DFE18SAN1R0ME0L; Core Material: Metal; Tolerance: 20%; DC Resistance (DCR): 144mR; Test Frequency: 1MHz; Shielding: Shielded; Current Rating: 1.6A; Saturation Current: 2A; Supplier 1: Arrow Electronics; Supplier Part Number 1: DFE18SAN1R0ME0L; Manufacturer Part Number: DFE18SAN1R0ME0L; RoHS: Yes; Category: Fixed Inductors; Stock 1: 21000; Pricing 1: 3000=0.16860 (USD); RoHS Compliant: Yes; ComponentLink1URL: http://www.farnell.com/datasheets/2616752.pdf?src-supplier=Farnell; ComponentLink1Description: http://www.farnell.com/datasheets/2616752.pdf?src-supplier=Farnell; Mount: Surface Mount; Case/Package: 0603; Case Code (Metric): 1608; Case Code (Imperial): 0603; Min Operating Temperature: -40°C; Max Operating Temperature: 85°C; Packaging: Cut Tape; ComponentLink2URL: http://search.murata.co.jp/Ceramy/image/img/P02/JETE243A-0037.pdf?src-supplier=Digi-Key; ComponentLink2Description: http://search.murata.co.jp/Ceramy/image/img/P02/JETE243A-0037.pdf?src-supplier=Digi-Key; ComponentLink3URL: http://www.farnell.com/datasheets/2616752.pdf?src-supplier=Newark; ComponentLink3Description: http://www.farnell.com/datasheets/2616752.pdf?src-supplier=Newark; ComponentLink4URL: http://www.farnell.com/datasheets/2616752.pdf?src-supplier=Element14; ComponentLink4Description: http://www.farnell.com/datasheets/2616752.pdf?src-supplier=Element14; Inductance: 1uH
L3 = Inductor: NONE; Manufacturer: Murata; AMBIQ PN: LQP15MN2N2B02D; Core Material: Non-Magnetic; DC Resistance (DCR): 300mR; Max DC Current: 220mA; Test Frequency: 500MHz; Shielding: Unshielded; Q Factor: 13; Self Resonant Frequency: 6GHz; Supplier 1: Avnet; Supplier Part Number 1: LQP15MN2N2B02D; Manufacturer Part Number: LQP15MN2N2B02D; RoHS: Yes; Category: Fixed Inductors; Pricing 1: 10000=0.04609, 20000=0.04476, 40000=0.04342 (USD); RoHS Compliant: Yes; ComponentLink1URL: https://datasheet.ciiva.com/11801/0900766b80f155d9-11801394.pdf?src-supplier=RSComponents; ComponentLink1Description: https://datasheet.ciiva.com/11801/0900766b80f155d9-11801394.pdf?src-supplier=RSComponents; Mount: Surface Mount; Case/Package: 0402; Case Code (Metric): 1005; Case Code (Imperial): 0402; Min Operating Temperature: -40°C; Max Operating Temperature: 85°C; Packaging: Tape and Reel; Package Quantity: 10000; Termination: SMD/SMT; Series: LQP15M; Resistor Type: Thin Film; Length: 1.1mm; Width: 0.02inch; Height: 0.35mm; Depth: 0.6mm; Lead Free: Lead Free; ComponentLink2URL: https://datasheet.ciiva.com/1039/l0075s0084lqp15m-1039847.pdf?src-supplier=Digi-Key; ComponentLink2Description: https://datasheet.ciiva.com/1039/l0075s0084lqp15m-1039847.pdf?src-supplier=Digi-Key; ComponentLink3URL: https://datasheet.ciiva.com/1039/l0075s0084lqp15m-1039846.pdf?src-supplier=Digi-Key; ComponentLink3Description: https://datasheet.ciiva.com/1039/l0075s0084lqp15m-1039846.pdf?src-supplier=Digi-Key; ComponentLink4URL: https://datasheet.ciiva.com/1039/l0075s0084lqp15m-1039848.pdf?src-supplier=Digi-Key; ComponentLink4Description: https://datasheet.ciiva.com/1039/l0075s0084lqp15m-1039848.pdf?src-supplier=Digi-Key; Inductance: 2.2nH; Current Rating: 220mA; DC Current: 220mA; Technology: THIN FILM; Rated Current-Max: 220mA; Height - Seated (Max): 0.018inch; Radiation Hardening: No; Military Standard: Not
L4 = Inductor: NONE; Manufacturer: Murata; AMBIQ PN: LQP15MN2N0B02D; Core Material: Non-Magnetic; DC Resistance (DCR): 300mR; Max DC Current: 220mA; Test Frequency: 500MHz; Shielding: Unshielded; Q Factor: 13; Self Resonant Frequency: 6GHz; Current: 130mA; Supplier 1: Arrow Electronics; Supplier Part Number 1: LQP15MN2N0B02D; Manufacturer Part Number: LQP15MN2N0B02D; RoHS: Yes; Category: Fixed Inductors; Stock 1: 9090; Pricing 1: 1=0.18190, 10=0.16280, 25=0.16100, 100=0.10650, 250=0.10520, 500=0.08710, 1000=0.07690, 3000=0.05610, 6000=0.05560 (USD); RoHS Compliant: Yes; ComponentLink1URL: https://datasheet.ciiva.com/11798/0900766b810228cf-11798602.pdf?src-supplier=RSComponents; ComponentLink1Description: https://datasheet.ciiva.com/11798/0900766b810228cf-11798602.pdf?src-supplier=RSComponents; Mount: Surface Mount; Case/Package: 0402; Case Code (Metric): 1005; Case Code (Imperial): 0402; Min Operating Temperature: -40°C; Max Operating Temperature: 85°C; Packaging: Tape and Reel; Package Quantity: 10000; Termination: SMD/SMT; Series: LQP15M; Resistor Type: Thin Film; Length: 1mm; Width: 0.02inch; Height: 0.35mm; Depth: 0.6mm; Lead Free: Lead Free; REACH SVHC: No SVHC; ComponentLink2URL: https://datasheet.ciiva.com/6705/l0075s0084lqp15m-6705214.pdf?src-supplier=Digi-Key; ComponentLink2Description: https://datasheet.ciiva.com/6705/l0075s0084lqp15m-6705214.pdf?src-supplier=Digi-Key; ComponentLink3URL: https://datasheet.ciiva.com/6705/l0075s0084lqp15m-6705210.pdf?src-supplier=Digi-Key; ComponentLink3Description: https://datasheet.ciiva.com/6705/l0075s0084lqp15m-6705210.pdf?src-supplier=Digi-Key; ComponentLink4URL: https://datasheet.ciiva.com/4977/product-4977814.pdf?src-supplier=Mouser; ComponentLink4Description: https://datasheet.ciiva.com/4977/product-4977814.pdf?src-supplier=Mouser; ComponentLink5URL: https://datasheet.ciiva.com/8510/l0075s0084lqp15m-8510303.pdf?src-supplier=Avnet; ComponentLink5Description: https://datasheet.ciiva.com/8510/l0075s0084lqp15m-8510303.pdf?src-supplier=Avnet; ComponentLink6URL: https://datasheet.ciiva.com/16397/l0075s0084lqp15m-16397565.pdf?src-supplier=Future+Electronics; ComponentLink6Description: https://datasheet.ciiva.com/16397/l0075s0084lqp15m-16397565.pdf?src-supplier=Future+Electronics; Inductance: 2nH; Current Rating: 220mA; DC Current: 220mA; Technology: THIN FILM; Rated Current-Max: 220mA; Height - Seated (Max): 0.018inch; Radiation Hardening: No; Military Standard: Not
R4 = Resistor: CRCW Series 0402 0.2 W 0 Ohm Jumper Surface Mount Thick Film Chip Resistor; Manufacturer: Vishay Dale; AMBIQ PN: CRCW04020000Z0EDHP; Resistance: 0R; Power Rating: 200mW; Voltage Rating: 50V; Max Power Dissipation: 125mW; Temperature Coefficient: 0ppm/°C; Supplier 1: Newark; Supplier Part Number 1: 68R2982; Manufacturer Part Number: CRCW04020000Z0EDHP; RoHS: Yes; Category: Chip SMD Resistors; Stock 1: 60000; Pricing 1: 1=0.01500, 10000=0.01500 (USD); Mount: Surface Mount; Case/Package: 0402; Weight: 2.3E-05oz; Case Code (Metric): 1005; Case Code (Imperial): 0402; Contact Plating: Tin; Size Code: 0402; Min Operating Temperature: -55°C; Max Operating Temperature: 155°C; Package Quantity: 1; Packaging: Tape and Reel; Resistor Type: Thick Film; Number of Terminations: 2; Termination: SMD/SMT; Voltage Rating (DC): 50V; Features: Automotive AEC-Q200; Series: CRCW-HP; Technology: THICK FILM; Construction: Rectangular; Length: 1mm; Width: 0.02inch; Height: 0.3mm; Depth: 0.5mm; Radiation Hardening: No; REACH SVHC: Unknown; Military Standard: Not; Lead Free: Lead Free; RoHS Compliant: Yes; ComponentLink1URL: https://datasheet.ciiva.com/7725/crcwhpe3-7725758.pdf?src-supplier=Element14; ComponentLink1Description: https://datasheet.ciiva.com/7725/crcwhpe3-7725758.pdf?src-supplier=Element14; ComponentLink2URL: https://datasheet.ciiva.com/28621/1912814-28621324.pdf?src-supplier=Element14; ComponentLink2Description: https://datasheet.ciiva.com/28621/1912814-28621324.pdf?src-supplier=Element14; ComponentLink3URL: https://datasheet.ciiva.com/2470/crcwhpe3-2470556.pdf?src-supplier=Digi-Key
R7 = Resistor: RES SMD 100K OHM 1% 1/10W 0402; Manufacturer: Panasonic; AMBIQ PN: ERJ-2RKF1003X; Resistance: 100kR; Power Rating: 100mW; Voltage Rating: 50V; Temperature Coefficient: 100ppm/°C; Supplier 1: Arrow Electronics; Supplier Part Number 1: ERJ-2RKF1003X; Manufacturer Part Number: ERJ-2RKF1003X; RoHS: Yes; Category: Chip SMD Resistors; Stock 1: 267708; Pricing 1: 10000=0.00840 (USD); Mount: Surface Mount; Case/Package: 0402; Weight: 0.000388oz; Case Code (Metric): 1005; Case Code (Imperial): 0402; Contact Plating: Tin; Min Operating Temperature: -55°C; Max Operating Temperature: 155°C; Package Quantity: 10000; Packaging: Cut Tape; Resistor Type: Thick Film; Number of Terminations: 2; Termination: SMD/SMT; Max Power Dissipation: 100mW; Voltage Rating (DC): 50V; Features: Automotive AEC-Q200; Series: ERJ-2Rx; Technology: THICK FILM; Length: 1mm; Width: 0.5mm; Height: 0.35mm; Depth: 0.5mm; Radiation Hardening: No; REACH SVHC: No SVHC; Military Standard: Not; Lead Free: Lead Free; RoHS Compliant: Yes; ComponentLink1URL: https://datasheet.ciiva.com/34303/1987038-34303550.pdf?src-supplier=Jameco; ComponentLink1Description: https://datasheet.ciiva.com/34303/1987038-34303550.pdf?src-supplier=Jameco; ComponentLink2URL: https://datasheet.ciiva.com/11821/0900766b80f80784-11821175.pdf?src-supplier=RSComponents; ComponentLink2Description: https://datasheet.ciiva.com/11821/0900766b80f80784-11821175.pdf?src-supplier=RSComponents; ComponentLink3URL: https://datasheet.ciiva.com/7830/aoa0000ce2-7830725.pdf?src-supplier=Element14; Tolerance: 1%; Number of Pins: 2
S1 = TS2306A-240GF-MSM-9_C388290: Switch (2-Pin Push); Manufacturer_Name: Shou Han; Datasheet Link: https://datasheet.lcsc.com/szlcsc/1904241742_SHOU-HAN-TS2306A-240gf-MSM-9_C388290.pdf; Height: 1mm; Manufacturer_Part_Number: TS2306A-240GF-MSM-9_C388290
U1 = AMA4B2KK-KXR-B2: None; Manufacturer: AMBIQ; AMBIQ PN: APOLLO4BPKXR; IC TYPE: MCU; Manufacturer Part Number: AMA4B2KK-KXR-B2; Category: Microcontrollers
Y1 = 2x2_Crystal: NONE; Manufacturer: Abracon; AMBIQ PN: ABM12W-32.0000MHZ-6-D1X-T3; Load Capacitance: 6pF; ESR (Equivalent Series Resistance): 100R; Frequency Tolerance: 10ppm; Frequency Stability: 20ppm; Supplier 1: Mouser; Supplier Part Number 1: 815-12W32-6D1XT; Manufacturer Part Number: ABM12W-32.0000MHZ-6-D1X-T3; RoHS: Yes; Category: Crystals; Stock 1: 2341; Pricing 1: 1=0.99000, 10=0.88400, 50=0.88400, 100=0.73000, 1000=0.57600, 10000=0.53700 (USD); Mount: Surface Mount; Case/Package: SMD/SMT; Min Operating Temperature: -40°C; Max Operating Temperature: 85°C; Packaging: Tape and Reel; Frequency: 32MHz; ComponentLink1URL: https://abracon.com/Resonators/ABM12W.pdf?src-supplier=Digi-Key; ComponentLink1Description: https://abracon.com/Resonators/ABM12W.pdf?src-supplier=Digi-Key; RoHS Compliant: Yes
Y2 = 1x1_Crystal: NONE; Manufacturer: TXC; AMBIQ PN: 9HT12-32.768KDZY-T; Load Capacitance: 7pF; ESR (Equivalent Series Resistance): 90kR; Frequency Tolerance: 20ppm; Supplier 1: Newark; Supplier Part Number 1: 45AC5777; Manufacturer Part Number: 9HT12-32.768KDZY-T; RoHS: Yes; Category: Crystals; Stock 1: 2496; Pricing 1: 1=1.39000, 10=1.33000, 25=1.26000, 50=1.19000, 100=1.12000 (USD); Mount: Surface Mount; Case/Package: SMD/SMT; Min Operating Temperature: -40°C; Max Operating Temperature: 85°C; Packaging: Tape and Reel; Frequency: 32.768kHz; Length: 0.063inch; Width: 0.039inch; Height: 0.02inch; Lead Free: Lead Free; ComponentLink1URL: http://www.txccrystal.com/images/pdf/number-crystal-khz.pdf?src-supplier=Digi-Key; ComponentLink1Description: http://www.txccrystal.com/images/pdf/number-crystal-khz.pdf?src-supplier=Digi-Key; ComponentLink2URL: http://www.txccrystal.com/images/pdf/9ht12.pdf?src-supplier=Digi-Key; ComponentLink2Description: http://www.txccrystal.com/images/pdf/9ht12.pdf?src-supplier=Digi-Key